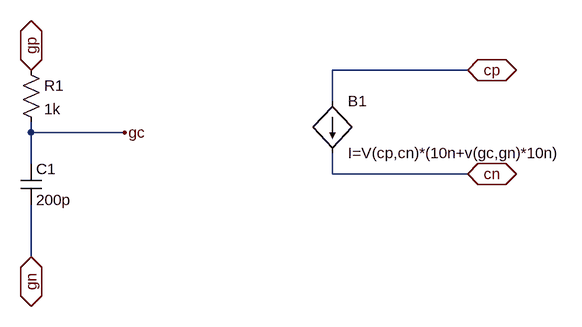
[diagram p0: schematic SymbCapteurGaz.asc]
SymbCapteurGaz.asc, the LTspice schematic file:
Version 4
SHEET 1 880 680
WIRE 160 160 -48 160
WIRE -48 208 -48 160
WIRE -512 256 -512 240
WIRE -368 256 -512 256
WIRE -512 304 -512 256
WIRE -48 320 -48 288
WIRE 160 320 -48 320
WIRE -512 448 -512 368
FLAG -368 256 gc
FLAG -512 160 gp
IOPIN -512 160 BiDir
FLAG -512 448 gn
IOPIN -512 448 BiDir
FLAG 160 160 cp
IOPIN 160 160 BiDir
FLAG 160 320 cn
IOPIN 160 320 BiDir
SYMBOL res -528 144 R0
SYMATTR InstName R1
SYMATTR Value 1k
SYMBOL cap -528 304 R0
SYMATTR InstName C1
SYMATTR Value 200p
SYMBOL bi -48 208 R0
SYMATTR InstName B1
SYMATTR Value I=V(cp,cn)*(10n+v(gc,gn)*10n)

The netlist it stands for:
* SymbCapteurGaz.asc
R1 gp gc 1k
C1 gc gn 200p
B1 cp cn I=V(cp,cn)*(10n+v(gc,gn)*10n)
.backanno
.end